# EAGLE schematic charging (EAGLE 7.4.0)
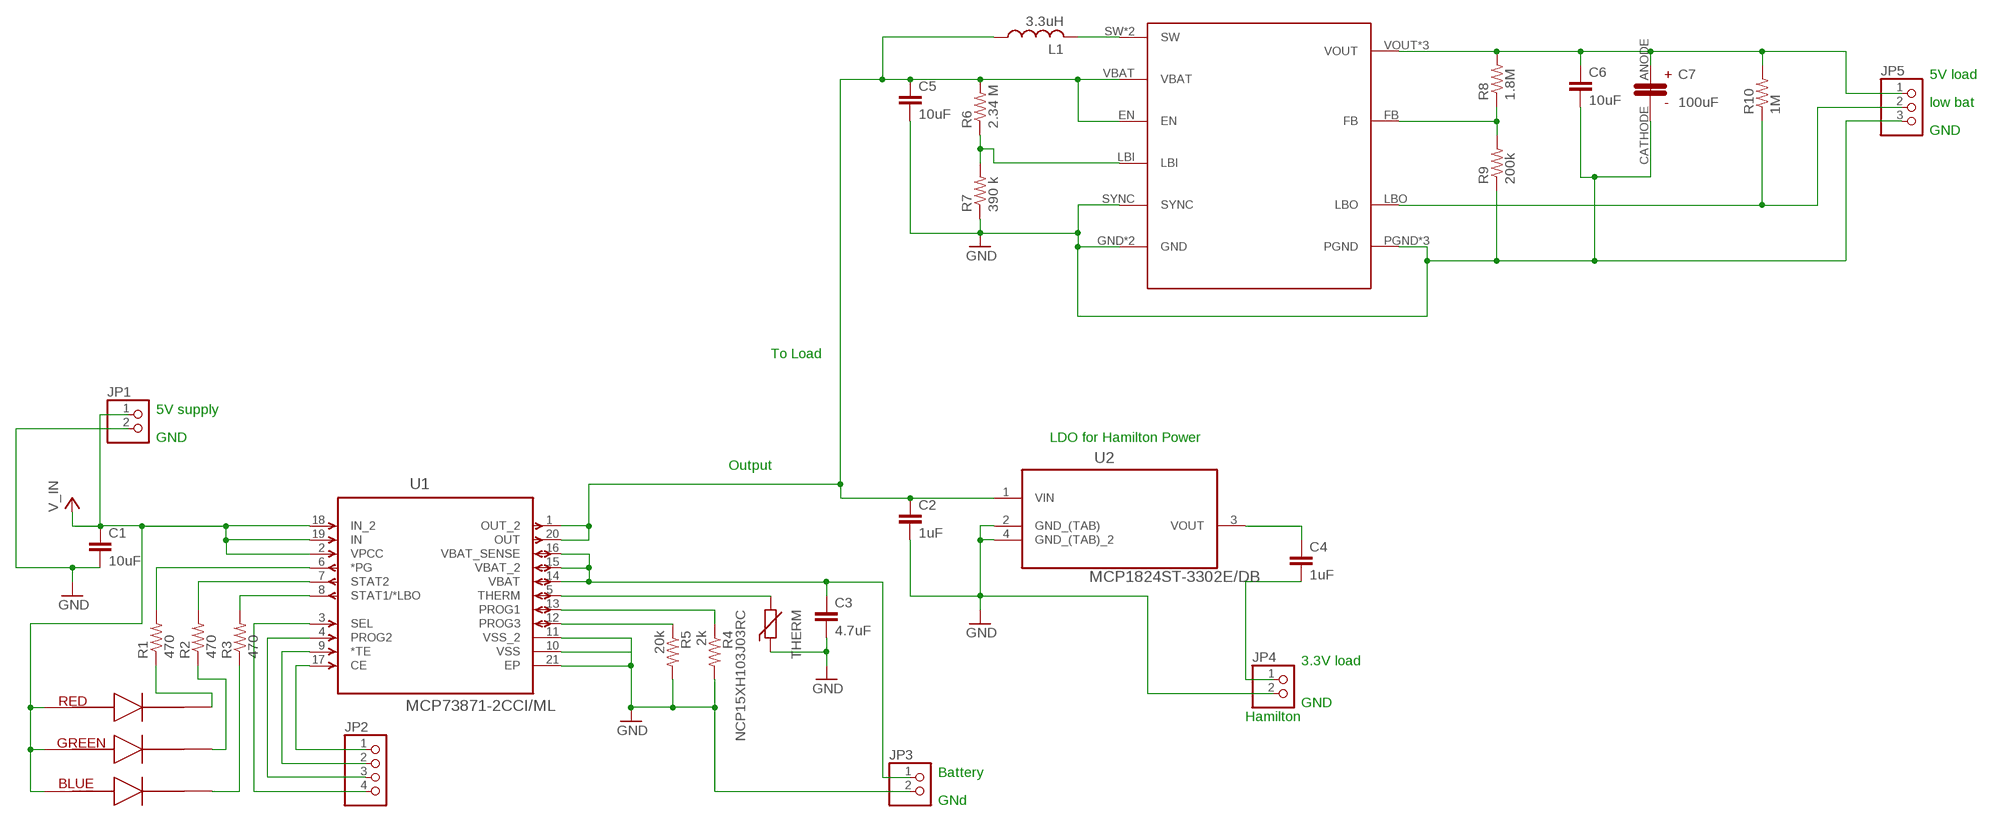
[diagram p0: schematic, sheet 1]

## Parts
C1  10uF  C-EUC0805  [C0805]
C2  1uF  C-EUC0603K  [C0603K]
C3  4.7uF  C-EUC0805  [C0805]
C4  1uF  C-EUC0603K  [C0603K]
C5  10uF  C-EUC0603K  [C0603K]
C6  10uF  C-EUC0603K  [C0603K]
C7  100uF  T491C686K010AT  [6032]
JP1  PINHD-1X2  [1X02]
JP2  PINHD-1X4  [1X04]
JP3  PINHD-1X2  [1X02]
JP4  PINHD-1X2  [1X02]
JP5  PINHD-1X3  [1X03]
L1  3.3uH  L-US  [2-SMD]
R1  470  R-US_R0805  [R0805]
R2  470  R-US_R0805  [R0805]
R3  470  R-US_R0805  [R0805]
R4  2k  R-US_R0805  [R0805]
R5  20k  R-US_R0805  [R0805]
R6  2.34 M  R-US_R0603  [R0603]
R7  390 k  R-US_R0603  [R0603]
R8  1.8M  R-US_R0603  [R0603]
R9  200k  R-US_R0603  [R0603]
R10  1M  R-US_R0603  [R0603]
THERM  NCP15XH103J03RC  [CT/CN0402]
U1  MCP73871-2CCI/ML  [QFN50P400X400X100-21N]
U2  MCP1824ST-3302E/DB  [SOT230P700X180-4N]
U$1  CLP6C-FKB  [CREE_PLCC6_3-IN-1_SMD_LED_CLP6C-FKB]
U$2  TPS61090  [QFN-16]

## Nets
GND: C1.2 C2.2 C3.2 C5.2 C6.2 C7.CATHODE JP1.2 JP3.2 JP4.2 JP5.3 R4.2 R5.2 R7.1 R9.1 THERM.1 U1.10(VSS) U1.11(VSS_2) U1.21(EP) U2.2(GND_(TAB)) U2.4(GND_(TAB)_2) U$2.GND U$2.P$17(GND) U$2.PGND U$2.PGND_2(PGND) U$2.PGND_3(PGND) U$2.SYNC
N$1: R3.2 U1.8(STAT1/*LBO)
N$2: R2.2 U1.7(STAT2)
N$3: R1.2 U1.6(*PG)
N$4: R1.1 U$1.RED_CATHODE
N$5: R2.1 U$1.GREEN_CATHODE
N$6: R3.1 U$1.BLUE_CATHODE
N$7: JP2.1 U1.17(CE)
N$8: JP2.2 U1.9(*TE)
N$9: JP2.3 U1.4(PROG2)
N$10: JP2.4 U1.3(SEL)
N$11: C2.1 C5.1 L1.P$1 R6.2 U1.1(OUT_2) U1.20(OUT) U2.1(VIN) U$2.EN U$2.VBAT
N$12: C3.1 JP3.1 U1.14(VBAT) U1.15(VBAT_2) U1.16(VBAT_SENSE)
N$13: THERM.2 U1.5(THERM)
N$14: R4.1 U1.13(PROG1)
N$15: C4.2 JP4.1
N$16: R5.1 U1.12(PROG3)
N$17: C4.1 U2.3(VOUT)
N$18: R6.1 R7.2 U$2.LBI
N$19: L1.P$2 U$2.SW U$2.SW_2(SW)
N$20: C6.1 C7.ANODE JP5.1 R8.2 R10.2 U$2.VOUT U$2.VOUT_2(VOUT) U$2.VOUT_3(VOUT)
N$21: R8.1 R9.2 U$2.FB
N$23: JP5.2 R10.1 U$2.LBO
VCC: C1.1 JP1.1 U1.2(VPCC) U1.18(IN_2) U1.19(IN) U$1.BLUE_ANODE U$1.GREEN_ANODE U$1.RED_ANODE ; supply symbol labelled V_IN

## Notes on the sheet
- 5V load
- low bat
- GND
- To Load
- 5V supply
- GND | LDO for Hamilton Power
- Output
- 3.3V load
- GND
- Hamilton
- Battery
- GNd

## Library data of the parts
C1-C6 = resistor:C-EU: CAPACITOR, European symbol
C7 = insole:T491C686K010AT
JP1 JP3 JP4 = pinhead:PINHD-1X2: PIN HEADER
JP2 = pinhead:PINHD-1X4: PIN HEADER
JP5 = pinhead:PINHD-1X3: PIN HEADER
L1 = insole:L-US: INDUCTOR, American symbol
R1-R10 = resistor:R-US_: RESISTOR, American symbol
THERM = varistor:NCP15XH103J03RC
U1 = Microchip_By_element14_Batch_1:MCP73871-2CCI/ML: IC, BATTERY CHARGER, 1A; MPN: MCP73871-2CCI/ML; OC_FARNELL: 1642489; OC_NEWARK: 54M4957; PACKAGE: QFN-20; SUPPLIER: Microchip
U2 = Microchip_By_element14_Batch_1:MCP1824ST-3302E/DB: IC, LDO VOLT REG, 3.3V, 0.3A,; MPN: MCP1824ST-3302E/DB; OC_FARNELL: 1578379; OC_NEWARK: 05N1293; PACKAGE: SOT-223-3; SUPPLIER: Microchip
U$1 = insole:CLP6C-FKB
U$2 = insole:TPS61090